# Altium schematic sheet FM_MODULE.SchDoc
size A4; SheetNumber: 6; SheetTotal: 11
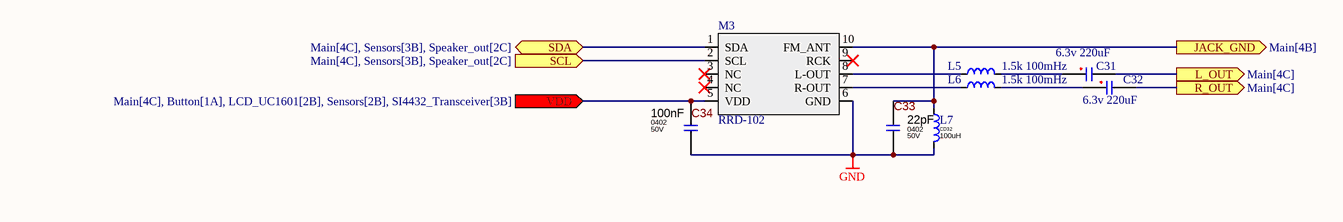
[diagram p0: FM_MODULE.SchDoc]

## Parts
C31  6.3v 220uF  [Tantalum TYPE-B]
C32  6.3v 220uF  [Tantalum TYPE-B]
C33  Package: 0402  Voltage: 50V  [Cap_0402]  (hidden comment: 22pF)
C34  Package: 0402  Voltage: 50V  [Cap_0402]  (hidden comment: 100nF)
L5  1.5k 100mHz  [Cap_0805]
L6  1.5k 100mHz  [Cap_0805]
L7  value 100uH  [CD32]  (hidden comment: CD32)
M3  RRD-102  [RRD-102]

## Ports
JACK_GND (out, see Main[4B]), L_OUT (out, see Main[4C]), R_OUT (out, see Main[4C]), SCL (in, see Main[4C], Sensors[3B], Speaker_out[2C]), SDA (bidir, see Main[4C], Sensors[3B], Speaker_out[2C]), VDD (in, see Main[4C], Button[1A], LCD_UC1601[2B], Sensors[2B], SI4432_Transceiver[3B])

## Nets
GND: C33.2 C34.2 L7.2 M3.6(GND)
JACK_GND: C33.1 L7.1 M3.10(FM_ANT) ; port JACK_GND
L_OUT: C31.2 ; port L_OUT
R_OUT: C32.2 ; port R_OUT
SCL: M3.2(SCL) ; port SCL
SDA: M3.1(SDA) ; port SDA
VDD: C34.1 M3.5(VDD) ; port VDD
NetC31_1: C31.1 L5.2
NetC32_1: C32.1 L6.2
NetL5_1: L5.1 M3.8(L-OUT)
NetL6_1: L6.1 M3.7(R-OUT)

Not connected (* = marked no-connect by the designer): M3 3(NC)* 4(NC)* 9(RCK)*

## Library data of the parts
C31 C32 = Tantalum_TYPE-B
C33 = Cap_0402_22pF: 22pF 50V  ±25% 0402 Ceramic Capacitor; Component Type: SMD; Tolerance: ±25%; ComponentLink1URL: https://search.murata.co.jp/Ceramy/image/img/A01X/G101/ENG/GRM31CR60J107ME39-01.pdf; ComponentLink1Description: Datasheet; Value: 22pF
C34 = Cap_0402_100nF: 100nF 50V  ±25% 0402 Ceramic Capacitor; Component Type: SMD; Tolerance: ±25%; ComponentLink1URL: https://search.murata.co.jp/Ceramy/image/img/A01X/G101/ENG/GRM31CR60J107ME39-01.pdf; ComponentLink1Description: Datasheet; Value: 100nF
L5 L6 = 0805
L7 = CD32: 2.2uH; Size: CD32
M3 = RRD-102(RDA5807M)